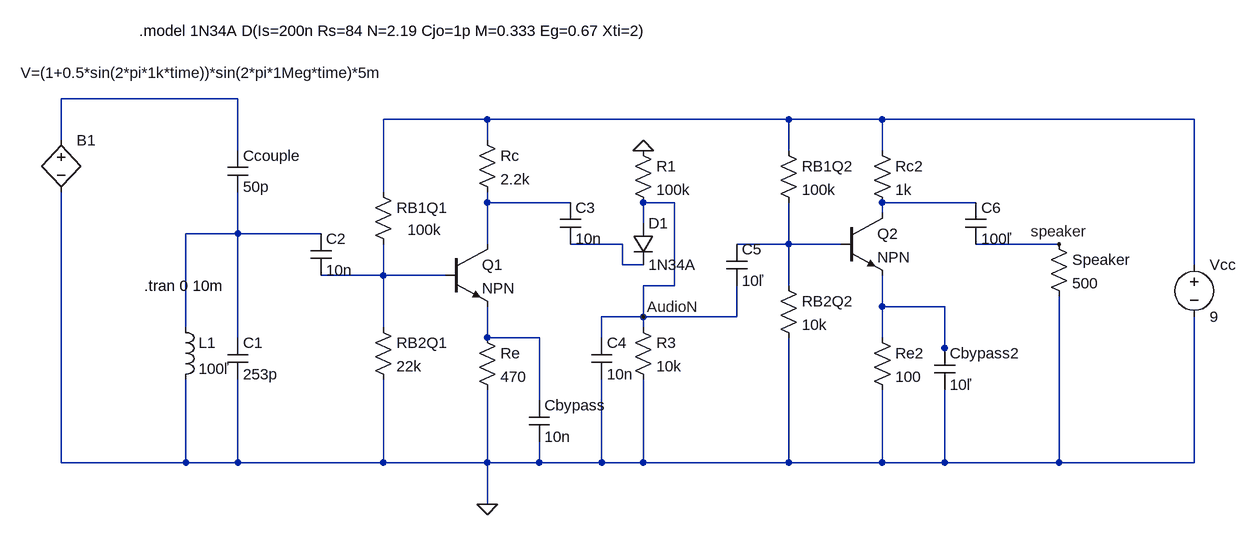
[diagram p0: schematic LtSpiceV4.asc]
LtSpiceV4.asc, the LTspice schematic file:
Version 4.1
SHEET 1 1828 680
WIRE 288 -80 16 -80
WIRE 672 -48 512 -48
WIRE 1136 -48 672 -48
WIRE 1280 -48 1136 -48
WIRE 1760 -48 1280 -48
WIRE 16 -16 16 -80
WIRE 672 -16 672 -48
WIRE 288 0 288 -80
WIRE 1136 0 1136 -48
WIRE 1280 0 1280 -48
WIRE 512 64 512 -48
WIRE 672 80 672 64
WIRE 800 80 672 80
WIRE 960 80 912 80
WIRE 1424 80 1280 80
WIRE 1280 96 1280 80
WIRE 912 112 912 80
WIRE 288 128 288 64
WIRE 288 128 208 128
WIRE 416 128 288 128
WIRE 672 144 672 80
WIRE 880 144 800 144
WIRE 1136 144 1136 80
WIRE 1136 144 1056 144
WIRE 1216 144 1136 144
WIRE 1552 144 1424 144
WIRE 880 176 880 144
WIRE 912 176 880 176
WIRE 1760 176 1760 -48
WIRE 512 192 512 144
WIRE 512 192 416 192
WIRE 608 192 512 192
WIRE 960 208 960 80
WIRE 960 208 912 208
WIRE 1136 208 1136 144
WIRE 1280 240 1280 192
WIRE 1376 240 1280 240
WIRE 912 256 912 208
WIRE 912 256 848 256
WIRE 1056 256 1056 208
WIRE 1056 256 912 256
WIRE 208 272 208 128
WIRE 512 272 512 192
WIRE 912 272 912 256
WIRE 288 288 288 128
WIRE 672 288 672 240
WIRE 752 288 672 288
WIRE 848 288 848 256
WIRE 1280 288 1280 240
WIRE 1376 304 1376 240
WIRE 1376 320 1376 304
WIRE 752 384 752 288
WIRE 16 480 16 64
WIRE 208 480 208 352
WIRE 208 480 16 480
WIRE 288 480 288 352
WIRE 288 480 208 480
WIRE 512 480 512 352
WIRE 512 480 288 480
WIRE 672 480 672 368
WIRE 672 480 512 480
WIRE 752 480 752 448
WIRE 752 480 672 480
WIRE 848 480 848 352
WIRE 848 480 752 480
WIRE 912 480 912 352
WIRE 912 480 848 480
WIRE 1136 480 1136 288
WIRE 1136 480 912 480
WIRE 1280 480 1280 368
WIRE 1280 480 1136 480
WIRE 1376 480 1376 368
WIRE 1376 480 1280 480
WIRE 1552 480 1552 224
WIRE 1552 480 1376 480
WIRE 1760 480 1760 256
WIRE 1760 480 1552 480
WIRE 672 544 672 480
FLAG 912 256 AudioN
FLAG 1552 144 speaker
FLAG 672 544 0
FLAG 912 0 0
SYMBOL cap 272 288 R0
SYMATTR InstName C1
SYMATTR Value 253p
SYMBOL npn 608 144 R0
SYMATTR InstName Q1
SYMBOL res 656 -32 R0
SYMATTR InstName Rc
SYMATTR Value 2.2k
SYMBOL res 656 272 R0
SYMATTR InstName Re
SYMATTR Value 470
SYMBOL voltage 1760 160 R0
WINDOW 123 0 0 Left 0
WINDOW 39 0 0 Left 0
SYMATTR InstName Vcc
SYMATTR Value 9
SYMBOL cap 784 80 R0
SYMATTR InstName C3
SYMATTR Value 10n
SYMBOL res 896 256 R0
SYMATTR InstName R3
SYMATTR Value 10k
SYMBOL cap 832 288 R0
SYMATTR InstName C4
SYMATTR Value 10n
SYMBOL npn 1216 96 R0
SYMATTR InstName Q2
SYMBOL res 1264 -16 R0
SYMATTR InstName Rc2
SYMATTR Value 1k
SYMBOL res 1264 272 R0
SYMATTR InstName Re2
SYMATTR Value 100
SYMBOL res 1536 128 R0
SYMATTR InstName Speaker
SYMATTR Value 500
SYMBOL res 496 48 R0
WINDOW 3 53 74 Left 2
SYMATTR Value 100k
SYMATTR InstName RB1Q1
SYMBOL res 496 256 R0
SYMATTR InstName RB2Q1
SYMATTR Value 22k
SYMBOL cap 1040 144 R0
SYMATTR InstName C5
SYMATTR Value 10ľ
SYMBOL res 1120 -16 R0
SYMATTR InstName RB1Q2
SYMATTR Value 100k
SYMBOL res 1120 192 R0
SYMATTR InstName RB2Q2
SYMATTR Value 10k
SYMBOL diode 896 112 R0
SYMATTR InstName D1
SYMATTR Value 1N34A
SYMBOL bv 16 -32 R0
WINDOW 3 -62 -88 Left 2
SYMATTR Value V=(1+0.5*sin(2*pi*1k*time))*sin(2*pi*1Meg*time)*5m
SYMATTR InstName B1
SYMBOL cap 272 0 R0
SYMATTR InstName Ccouple
SYMATTR Value 50p
SYMBOL cap 736 384 R0
SYMATTR InstName Cbypass
SYMATTR Value 10n
SYMBOL res 896 -16 R0
SYMATTR InstName R1
SYMATTR Value 100k
SYMBOL cap 1408 80 R0
SYMATTR InstName C6
SYMATTR Value 100ľ
SYMBOL cap 1360 304 R0
SYMATTR InstName Cbypass2
SYMATTR Value 10ľ
SYMBOL cap 400 128 R0
SYMATTR InstName C2
SYMATTR Value 10n
SYMBOL ind 192 256 R0
SYMATTR InstName L1
SYMATTR Value 100ľ
SYMATTR SpiceLine Rser=1m
TEXT 144 208 Left 2 !.tran 0 10m
TEXT 136 -184 Left 2 !.model 1N34A D(Is=200n Rs=84 N=2.19 Cjo=1p M=0.333 Eg=0.67 Xti=2)

The netlist it stands for:
* LtSpiceV4.asc
C1 N005 0 253p
Q1 N003 N008 N010 0 NPN
Rc N002 N003 2.2k
Re N010 0 470
Vcc N002 0 9
C3 N003 N006 10n
R3 AudioN 0 10k
C4 AudioN 0 10n
Q2 N004 N007 N009 0 NPN
Rc2 N002 N004 1k
Re2 N009 0 100
R§Speaker speaker 0 500
RB1Q1 N002 N008 100k
RB2Q1 N008 0 22k
C5 N007 AudioN 10ľ
RB1Q2 N002 N007 100k
RB2Q2 N007 0 10k
D1 AudioN N006 1N34A
B1 N001 0 V=(1+0.5*sin(2*pi*1k*time))*sin(2*pi*1Meg*time)*5m
Ccouple N001 N005 50p
Cbypass N010 0 10n
R1 0 AudioN 100k
C6 N004 speaker 100ľ
Cbypass2 N009 0 10ľ
C2 N005 N008 10n
L1 N005 0 100ľ Rser=1m
.model D D
.lib standard.dio
.model NPN NPN
.model PNP PNP
.lib standard.bjt
.tran 0 10m
.model 1N34A D(Is=200n Rs=84 N=2.19 Cjo=1p M=0.333 Eg=0.67 Xti=2)
.backanno
.end